# EAGLE schematic bac-bmb-t (EAGLE 6.6.0)
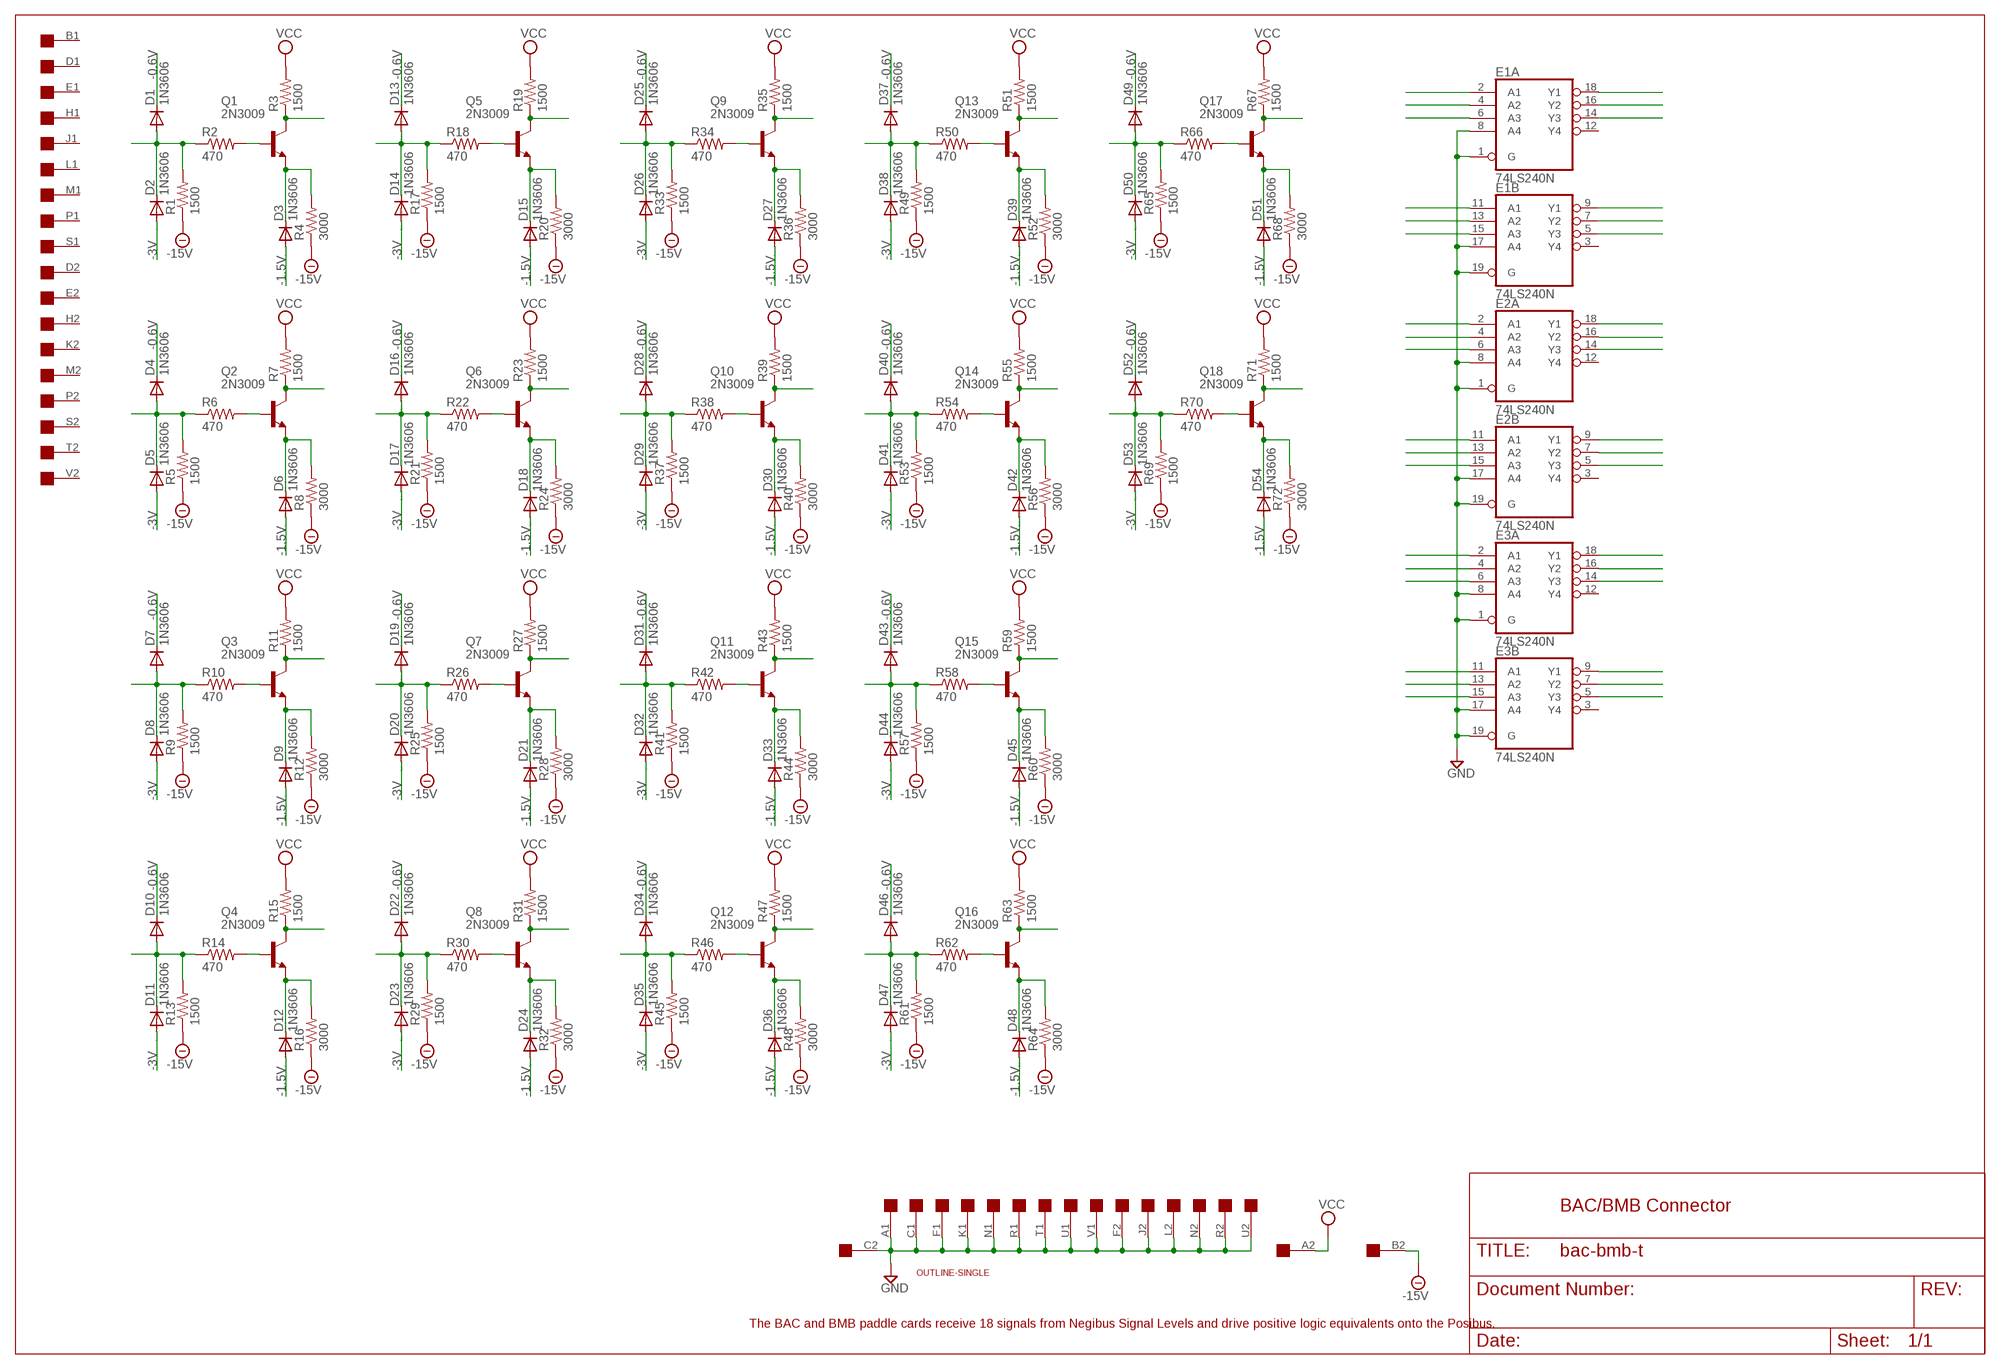
[diagram p0: schematic, sheet 1]

## Parts
D1  1N3606  DIODE-DO35-10  [DO35-10]
D2  1N3606  DIODE-DO35-10  [DO35-10]
D3  1N3606  DIODE-DO35-10  [DO35-10]
D4  1N3606  DIODE-DO35-10  [DO35-10]
D5  1N3606  DIODE-DO35-10  [DO35-10]
D6  1N3606  DIODE-DO35-10  [DO35-10]
D7  1N3606  DIODE-DO35-10  [DO35-10]
D8  1N3606  DIODE-DO35-10  [DO35-10]
D9  1N3606  DIODE-DO35-10  [DO35-10]
D10  1N3606  DIODE-DO35-10  [DO35-10]
D11  1N3606  DIODE-DO35-10  [DO35-10]
D12  1N3606  DIODE-DO35-10  [DO35-10]
D13  1N3606  DIODE-DO35-10  [DO35-10]
D14  1N3606  DIODE-DO35-10  [DO35-10]
D15  1N3606  DIODE-DO35-10  [DO35-10]
D16  1N3606  DIODE-DO35-10  [DO35-10]
D17  1N3606  DIODE-DO35-10  [DO35-10]
D18  1N3606  DIODE-DO35-10  [DO35-10]
D19  1N3606  DIODE-DO35-10  [DO35-10]
D20  1N3606  DIODE-DO35-10  [DO35-10]
D21  1N3606  DIODE-DO35-10  [DO35-10]
D22  1N3606  DIODE-DO35-10  [DO35-10]
D23  1N3606  DIODE-DO35-10  [DO35-10]
D24  1N3606  DIODE-DO35-10  [DO35-10]
D25  1N3606  DIODE-DO35-10  [DO35-10]
D26  1N3606  DIODE-DO35-10  [DO35-10]
D27  1N3606  DIODE-DO35-10  [DO35-10]
D28  1N3606  DIODE-DO35-10  [DO35-10]
D29  1N3606  DIODE-DO35-10  [DO35-10]
D30  1N3606  DIODE-DO35-10  [DO35-10]
D31  1N3606  DIODE-DO35-10  [DO35-10]
D32  1N3606  DIODE-DO35-10  [DO35-10]
D33  1N3606  DIODE-DO35-10  [DO35-10]
D34  1N3606  DIODE-DO35-10  [DO35-10]
D35  1N3606  DIODE-DO35-10  [DO35-10]
D36  1N3606  DIODE-DO35-10  [DO35-10]
D37  1N3606  DIODE-DO35-10  [DO35-10]
D38  1N3606  DIODE-DO35-10  [DO35-10]
D39  1N3606  DIODE-DO35-10  [DO35-10]
D40  1N3606  DIODE-DO35-10  [DO35-10]
D41  1N3606  DIODE-DO35-10  [DO35-10]
D42  1N3606  DIODE-DO35-10  [DO35-10]
D43  1N3606  DIODE-DO35-10  [DO35-10]
D44  1N3606  DIODE-DO35-10  [DO35-10]
D45  1N3606  DIODE-DO35-10  [DO35-10]
D46  1N3606  DIODE-DO35-10  [DO35-10]
D47  1N3606  DIODE-DO35-10  [DO35-10]
D48  1N3606  DIODE-DO35-10  [DO35-10]
D49  1N3606  DIODE-DO35-10  [DO35-10]
D50  1N3606  DIODE-DO35-10  [DO35-10]
D51  1N3606  DIODE-DO35-10  [DO35-10]
D52  1N3606  DIODE-DO35-10  [DO35-10]
D53  1N3606  DIODE-DO35-10  [DO35-10]
D54  1N3606  DIODE-DO35-10  [DO35-10]
E1  74LS240N  [DIL20]
E2  74LS240N  [DIL20]
E3  74LS240N  [DIL20]
Q1  2N3009  -NPN-TO5  [TO5]
Q2  2N3009  -NPN-TO5  [TO5]
Q3  2N3009  -NPN-TO5  [TO5]
Q4  2N3009  -NPN-TO5  [TO5]
Q5  2N3009  -NPN-TO5  [TO5]
Q6  2N3009  -NPN-TO5  [TO5]
Q7  2N3009  -NPN-TO5  [TO5]
Q8  2N3009  -NPN-TO5  [TO5]
Q9  2N3009  -NPN-TO5  [TO5]
Q10  2N3009  -NPN-TO5  [TO5]
Q11  2N3009  -NPN-TO5  [TO5]
Q12  2N3009  -NPN-TO5  [TO5]
Q13  2N3009  -NPN-TO5  [TO5]
Q14  2N3009  -NPN-TO5  [TO5]
Q15  2N3009  -NPN-TO5  [TO5]
Q16  2N3009  -NPN-TO5  [TO5]
Q17  2N3009  -NPN-TO5  [TO5]
Q18  2N3009  -NPN-TO5  [TO5]
R1  1500  R-US_0207/10  [0207/10]
R2  470  R-US_0207/10  [0207/10]
R3  1500  R-US_0207/10  [0207/10]
R4  3000  R-US_0207/10  [0207/10]
R5  1500  R-US_0207/10  [0207/10]
R6  470  R-US_0207/10  [0207/10]
R7  1500  R-US_0207/10  [0207/10]
R8  3000  R-US_0207/10  [0207/10]
R9  1500  R-US_0207/10  [0207/10]
R10  470  R-US_0207/10  [0207/10]
R11  1500  R-US_0207/10  [0207/10]
R12  3000  R-US_0207/10  [0207/10]
R13  1500  R-US_0207/10  [0207/10]
R14  470  R-US_0207/10  [0207/10]
R15  1500  R-US_0207/10  [0207/10]
R16  3000  R-US_0207/10  [0207/10]
R17  1500  R-US_0207/10  [0207/10]
R18  470  R-US_0207/10  [0207/10]
R19  1500  R-US_0207/10  [0207/10]
R20  3000  R-US_0207/10  [0207/10]
R21  1500  R-US_0207/10  [0207/10]
R22  470  R-US_0207/10  [0207/10]
R23  1500  R-US_0207/10  [0207/10]
R24  3000  R-US_0207/10  [0207/10]
R25  1500  R-US_0207/10  [0207/10]
R26  470  R-US_0207/10  [0207/10]
R27  1500  R-US_0207/10  [0207/10]
R28  3000  R-US_0207/10  [0207/10]
R29  1500  R-US_0207/10  [0207/10]
R30  470  R-US_0207/10  [0207/10]
R31  1500  R-US_0207/10  [0207/10]
R32  3000  R-US_0207/10  [0207/10]
R33  1500  R-US_0207/10  [0207/10]
R34  470  R-US_0207/10  [0207/10]
R35  1500  R-US_0207/10  [0207/10]
R36  3000  R-US_0207/10  [0207/10]
R37  1500  R-US_0207/10  [0207/10]
R38  470  R-US_0207/10  [0207/10]
R39  1500  R-US_0207/10  [0207/10]
R40  3000  R-US_0207/10  [0207/10]
R41  1500  R-US_0207/10  [0207/10]
R42  470  R-US_0207/10  [0207/10]
R43  1500  R-US_0207/10  [0207/10]
R44  3000  R-US_0207/10  [0207/10]
R45  1500  R-US_0207/10  [0207/10]
R46  470  R-US_0207/10  [0207/10]
R47  1500  R-US_0207/10  [0207/10]
R48  3000  R-US_0207/10  [0207/10]
R49  1500  R-US_0207/10  [0207/10]
R50  470  R-US_0207/10  [0207/10]
R51  1500  R-US_0207/10  [0207/10]
R52  3000  R-US_0207/10  [0207/10]
R53  1500  R-US_0207/10  [0207/10]
R54  470  R-US_0207/10  [0207/10]
R55  1500  R-US_0207/10  [0207/10]
R56  3000  R-US_0207/10  [0207/10]
R57  1500  R-US_0207/10  [0207/10]
R58  470  R-US_0207/10  [0207/10]
R59  1500  R-US_0207/10  [0207/10]
R60  3000  R-US_0207/10  [0207/10]
R61  1500  R-US_0207/10  [0207/10]
R62  470  R-US_0207/10  [0207/10]
R63  1500  R-US_0207/10  [0207/10]
R64  3000  R-US_0207/10  [0207/10]
R65  1500  R-US_0207/10  [0207/10]
R66  470  R-US_0207/10  [0207/10]
R67  1500  R-US_0207/10  [0207/10]
R68  3000  R-US_0207/10  [0207/10]
R69  1500  R-US_0207/10  [0207/10]
R70  470  R-US_0207/10  [0207/10]
R71  1500  R-US_0207/10  [0207/10]
R72  3000  R-US_0207/10  [0207/10]
U$1  SINGLE  [EDGE-CON2]
U$2  OUTLINE-SINGLE  [SINGLE]

## Nets
-0.6V: D1.C D4.C D7.C D10.C D13.C D16.C D19.C D22.C D25.C D28.C D31.C D34.C D37.C D40.C D43.C D46.C D49.C D52.C
-1.5V: D3.A D6.A D9.A D12.A D15.A D18.A D21.A D24.A D27.A D30.A D33.A D36.A D39.A D42.A D45.A D48.A D51.A D54.A
-3V: D2.A D5.A D8.A D11.A D14.A D17.A D20.A D23.A D26.A D29.A D32.A D35.A D38.A D41.A D44.A D47.A D50.A D53.A
-15V: R1.1 R4.1 R5.1 R8.1 R9.1 R12.1 R13.1 R16.1 R17.1 R20.1 R21.1 R24.1 R25.1 R28.1 R29.1 R32.1 R33.1 R36.1 R37.1 R40.1 R41.1 R44.1 R45.1 R48.1 R49.1 R52.1 R53.1 R56.1 R57.1 R60.1 R61.1 R64.1 R65.1 R68.1 R69.1 R72.1 U$1.B2
GND: E1.1(A:G) E1.8(A:A4) E1.17(B:A4) E1.19(B:G) E2.1(A:G) E2.8(A:A4) E2.17(B:A4) E2.19(B:G) E3.1(A:G) E3.8(A:A4) E3.17(B:A4) E3.19(B:G) U$1.A1 U$1.C1 U$1.C2 U$1.F1 U$1.F2 U$1.J2 U$1.K1 U$1.L2 U$1.N1 U$1.N2 U$1.R1 U$1.R2 U$1.T1 U$1.U1 U$1.U2 U$1.V1
N$1: D1.A D2.C R1.2 R2.1
N$2: Q1.2(B) R2.2
N$3: D3.C Q1.1(E) R4.2
N$4: Q1.3(C) R3.1
N$5: D4.A D5.C R5.2 R6.1
N$6: Q2.2(B) R6.2
N$7: D6.C Q2.1(E) R8.2
N$8: Q2.3(C) R7.1
N$9: D7.A D8.C R9.2 R10.1
N$10: Q3.2(B) R10.2
N$11: D9.C Q3.1(E) R12.2
N$12: Q3.3(C) R11.1
N$13: D10.A D11.C R13.2 R14.1
N$14: Q4.2(B) R14.2
N$15: D12.C Q4.1(E) R16.2
N$16: Q4.3(C) R15.1
N$17: D13.A D14.C R17.2 R18.1
N$18: Q5.2(B) R18.2
N$19: D15.C Q5.1(E) R20.2
N$20: Q5.3(C) R19.1
N$21: D16.A D17.C R21.2 R22.1
N$22: Q6.2(B) R22.2
N$23: D18.C Q6.1(E) R24.2
N$24: Q6.3(C) R23.1
N$25: D19.A D20.C R25.2 R26.1
N$26: Q7.2(B) R26.2
N$27: D21.C Q7.1(E) R28.2
N$28: Q7.3(C) R27.1
N$29: D22.A D23.C R29.2 R30.1
N$30: Q8.2(B) R30.2
N$31: D24.C Q8.1(E) R32.2
N$32: Q8.3(C) R31.1
N$33: D25.A D26.C R33.2 R34.1
N$34: Q9.2(B) R34.2
N$35: D27.C Q9.1(E) R36.2
N$36: Q9.3(C) R35.1
N$37: D28.A D29.C R37.2 R38.1
N$38: Q10.2(B) R38.2
N$39: D30.C Q10.1(E) R40.2
N$40: Q10.3(C) R39.1
N$41: D31.A D32.C R41.2 R42.1
N$42: Q11.2(B) R42.2
N$43: D33.C Q11.1(E) R44.2
N$44: Q11.3(C) R43.1
N$45: D34.A D35.C R45.2 R46.1
N$46: Q12.2(B) R46.2
N$47: D36.C Q12.1(E) R48.2
N$48: Q12.3(C) R47.1
N$49: D37.A D38.C R49.2 R50.1
N$50: Q13.2(B) R50.2
N$51: D39.C Q13.1(E) R52.2
N$52: Q13.3(C) R51.1
N$53: D40.A D41.C R53.2 R54.1
N$54: Q14.2(B) R54.2
N$55: D42.C Q14.1(E) R56.2
N$56: Q14.3(C) R55.1
N$57: D43.A D44.C R57.2 R58.1
N$58: Q15.2(B) R58.2
N$59: D45.C Q15.1(E) R60.2
N$60: Q15.3(C) R59.1
N$61: D46.A D47.C R61.2 R62.1
N$62: Q16.2(B) R62.2
N$63: D48.C Q16.1(E) R64.2
N$64: Q16.3(C) R63.1
N$65: D49.A D50.C R65.2 R66.1
N$66: Q17.2(B) R66.2
N$67: D51.C Q17.1(E) R68.2
N$68: Q17.3(C) R67.1
N$69: D52.A D53.C R69.2 R70.1
N$70: Q18.2(B) R70.2
N$71: D54.C Q18.1(E) R72.2
N$72: Q18.3(C) R71.1
N$73: E1.4(A:A2)
N$74: E3.13(B:A2)
N$75: E1.2(A:A1)
N$76: E1.6(A:A3)
N$77: E1.11(B:A1)
N$78: E1.13(B:A2)
N$79: E1.15(B:A3)
N$80: E2.2(A:A1)
N$81: E2.4(A:A2)
N$82: E2.6(A:A3)
N$83: E2.11(B:A1)
N$84: E2.13(B:A2)
N$85: E2.15(B:A3)
N$86: E3.2(A:A1)
N$87: E3.4(A:A2)
N$88: E3.6(A:A3)
N$89: E3.11(B:A1)
N$90: E3.15(B:A3)
N$101: E2.9(B:Y1)
N$102: E2.7(B:Y2)
N$103: E2.5(B:Y3)
VCC: R3.2 R7.2 R11.2 R15.2 R19.2 R23.2 R27.2 R31.2 R35.2 R39.2 R43.2 R47.2 R51.2 R55.2 R59.2 R63.2 R67.2 R71.2 U$1.A2
Unconnected: E1.3(B:Y4) E1.5(B:Y3) E1.7(B:Y2) E1.9(B:Y1) E1.12(A:Y4) E1.14(A:Y3) E1.16(A:Y2) E1.18(A:Y1) E2.3(B:Y4) E2.12(A:Y4) E2.14(A:Y3) E2.16(A:Y2) E2.18(A:Y1) E3.3(B:Y4) E3.5(B:Y3) E3.7(B:Y2) E3.9(B:Y1) E3.12(A:Y4) E3.14(A:Y3) E3.16(A:Y2) E3.18(A:Y1) U$1.B1 U$1.D1 U$1.D2 U$1.E1 U$1.E2 U$1.H1 U$1.H2 U$1.J1 U$1.K2 U$1.L1 U$1.M1 U$1.M2 U$1.P1 U$1.P2 U$1.S1 U$1.S2 U$1.T2 U$1.V2

## Notes on the sheet
- BAC/BMB Connector
- The BAC and BMB paddle cards receive 18 signals from Negibus Signal Levels and drive positive logic equivalents onto the Posibus.

## Power pins joined to a net without a drawn wire
GND: E1.10(P:GND) E2.10(P:GND) E3.10(P:GND)
VCC: E1.20(P:VCC) E2.20(P:VCC) E3.20(P:VCC)

## Library data of the parts
D1-D54 = diode:DIODE-: DIODE
E1-E3 = 74xx-us:74*240: Octal BUFFER and LINE DRIVER, 3-state
Q1-Q18 = transistor:*-NPN-: NPN Transistror BF959 corrected 2008.03.06
R1-R72 = rcl:R-US_: RESISTOR, American symbol
U$1 = dec-con:SINGLE: Single-Height DEC board
U$2 = dec-con:OUTLINE-*: Board outlines for DEC boards.